# Altium project Solenoid-Switching-Board-v1.0.PrjPcb (part 5 of 5)
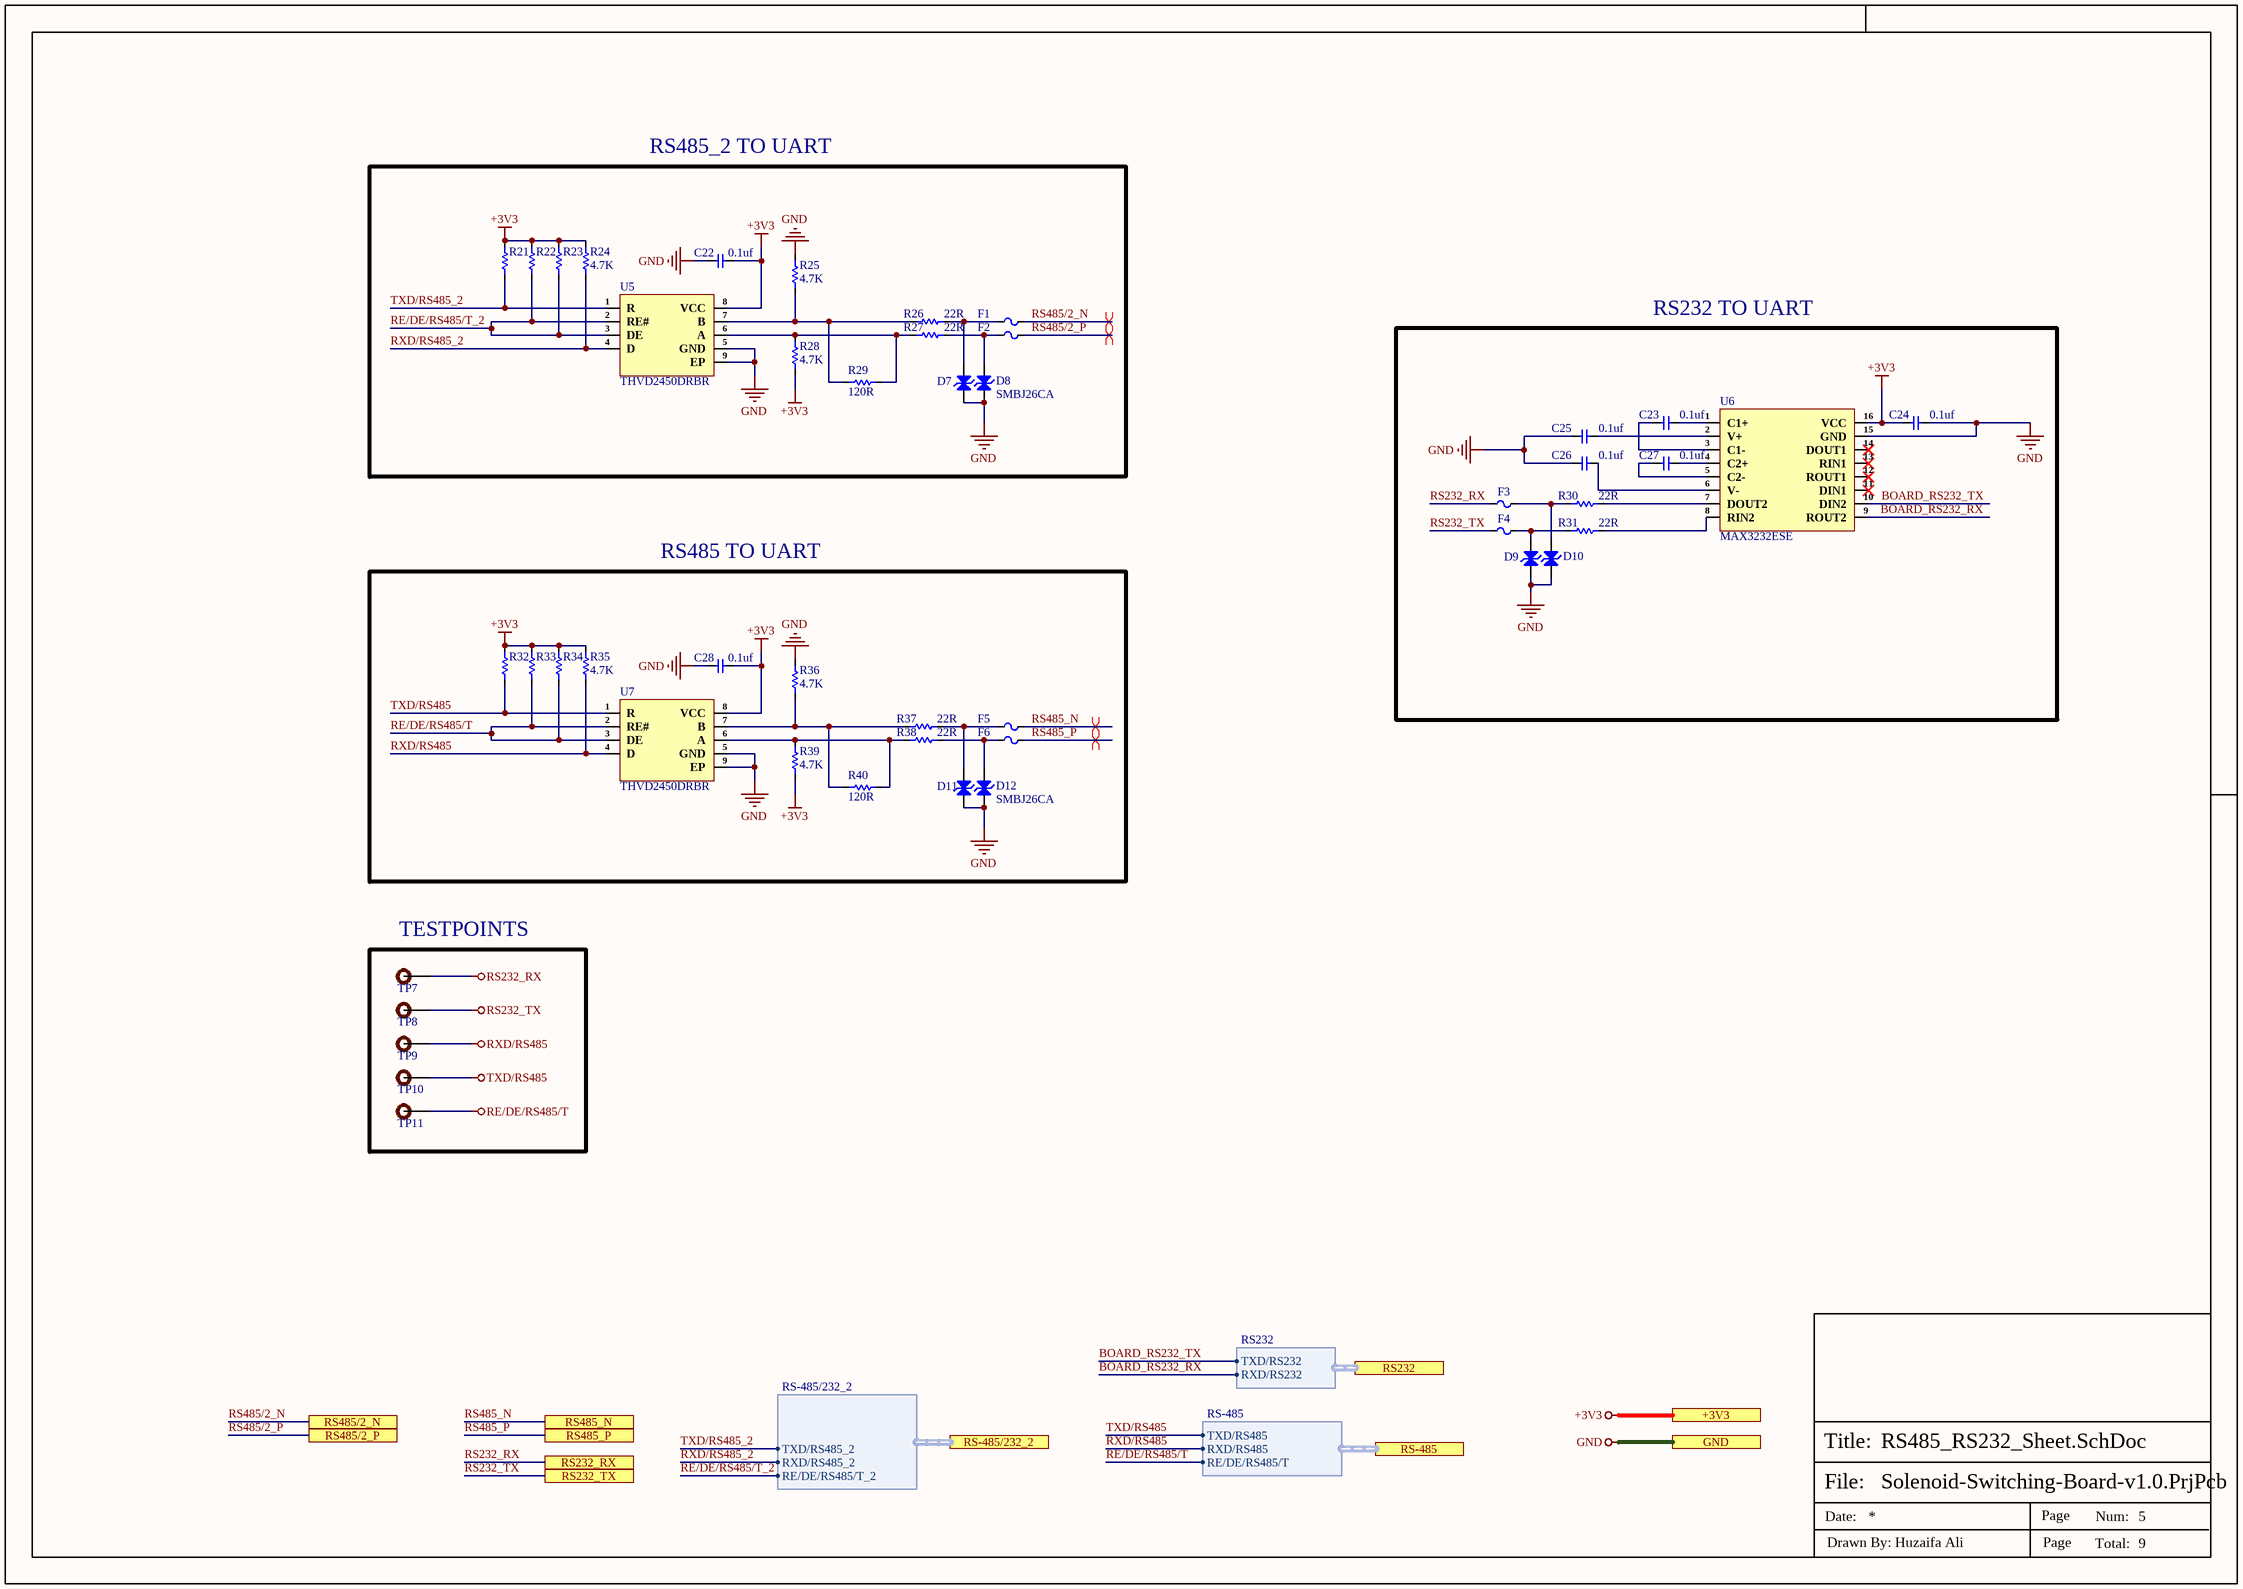
[diagram p9: RS485_RS232_Sheet.SchDoc]

## Nets that join several sheets
+3V3: CAN_Sheet (C20.2 U4.5), Controller_Sheet (10 pins), EtherCAT_Sheet (19 pins), Power_Sheet (5 pins), RJ45_Sheet (12 pins), RS485_RS232_Sheet (16 pins)
+5V: CAN_Sheet (6 pins), Power_Sheet (7 pins)
+24V: Connector_Sheet (34 pins), Power_Sheet (10 pins)
CAN_RX: CAN_Sheet (TP5.1 U4.4), Controller_Sheet (U3.15)
CAN_TX: CAN_Sheet (TP6.1 U4.1), Controller_Sheet (U3.16)
CHASIS GND: Connector_Sheet (16 pins), RJ45_Sheet (7 pins)
GND: CAN_Sheet (8 pins), Connector_Sheet (D13.1 J12.3 J16.1), Controller_Sheet (27 pins), EtherCAT_Sheet (26 pins), MOSFET_Sheet (48 pins), Power_Sheet (22 pins), RJ45_Sheet (10 pins), RS485_RS232_Sheet (18 pins)
RE/DE/RS485/T: Controller_Sheet (U3.20), RS485_RS232_Sheet (5 pins)
RS232_RX: Connector_Sheet (J15.2), RS485_RS232_Sheet (F3.1 TP7.1)
RS232_TX: Connector_Sheet (J15.1), RS485_RS232_Sheet (F4.1 TP8.1)
RXD/RS485: Controller_Sheet (U3.21), RS485_RS232_Sheet (R35.1 TP9.1 U7.4)
TXD/RS485: Controller_Sheet (U3.22), RS485_RS232_Sheet (R32.1 TP10.1 U7.1)
BOARD_RS232_RX: Controller_Sheet (U3.56), RS485_RS232_Sheet (U6.9)
BOARD_RS232_TX: Controller_Sheet (U3.55), RS485_RS232_Sheet (U6.10)
CAN_N: CAN_Sheet (R20.2 U4.12), Connector_Sheet (J12.2)
CAN_P: CAN_Sheet (R18.1 U4.13), Connector_Sheet (J12.1)
CONN1_NEG: Connector_Sheet (D17.2 J7.2), MOSFET_Sheet (Q1.2 Q1.4)
CONN2_NEG: Connector_Sheet (D22.2 J7.5), MOSFET_Sheet (Q2.2 Q2.4)
CONN3_NEG: Connector_Sheet (D26.2 J7.8), MOSFET_Sheet (Q3.2 Q3.4)
CONN4_NEG: Connector_Sheet (D30.2 J7.11), MOSFET_Sheet (Q4.2 Q4.4)
CONN5_NEG: Connector_Sheet (D19.2 J8.2), MOSFET_Sheet (Q5.2 Q5.4)
CONN6_NEG: Connector_Sheet (D23.2 J8.5), MOSFET_Sheet (Q6.2 Q6.4)
CONN7_NEG: Connector_Sheet (D27.2 J8.8), MOSFET_Sheet (Q7.2 Q7.4)
CONN8_NEG: Connector_Sheet (D31.2 J8.11), MOSFET_Sheet (Q8.2 Q8.4)
CONN9_NEG: Connector_Sheet (D20.2 J13.2), MOSFET_Sheet (Q9.2 Q9.4)
CONN10_NEG: Connector_Sheet (D24.2 J13.5), MOSFET_Sheet (Q10.2 Q10.4)
CONN11_NEG: Connector_Sheet (D28.2 J13.8), MOSFET_Sheet (Q11.2 Q11.4)
CONN12_NEG: Connector_Sheet (D32.2 J13.11), MOSFET_Sheet (Q12.2 Q12.4)
CONN13_NEG: Connector_Sheet (D21.2 J18.2), MOSFET_Sheet (Q13.2 Q13.4)
CONN14_NEG: Connector_Sheet (D25.2 J18.5), MOSFET_Sheet (Q14.2 Q14.4)
CONN15_NEG: Connector_Sheet (D29.2 J18.8), MOSFET_Sheet (Q15.2 Q15.4)
CONN16_NEG: Connector_Sheet (D33.2 J18.11), MOSFET_Sheet (Q16.2 Q16.4)
EN_CAN: CAN_Sheet (U4.6), Controller_Sheet (U3.36)
G1: Controller_Sheet (U3.2), MOSFET_Sheet (R64.2 R67.2)
G2: Controller_Sheet (U3.3), MOSFET_Sheet (R65.2 R68.2)
G3: Controller_Sheet (U3.41), MOSFET_Sheet (R66.2 R69.2)
G4: Controller_Sheet (U3.40), MOSFET_Sheet (R70.2 R99.2)
G5: Controller_Sheet (U3.23), MOSFET_Sheet (R75.2 R100.2)
G6: Controller_Sheet (U3.24), MOSFET_Sheet (R76.2 R101.2)
G7: Controller_Sheet (U3.25), MOSFET_Sheet (R77.2 R102.2)
G8: Controller_Sheet (U3.26), MOSFET_Sheet (R78.2 R103.2)
G9: Controller_Sheet (U3.27), MOSFET_Sheet (R83.2 R104.2)
G10: Controller_Sheet (U3.28), MOSFET_Sheet (R84.2 R105.2)
G11: Controller_Sheet (U3.29), MOSFET_Sheet (R85.2 R106.2)
G12: Controller_Sheet (U3.30), MOSFET_Sheet (R86.2 R107.2)
G13: Controller_Sheet (U3.31), MOSFET_Sheet (R91.2 R108.2)
G14: Controller_Sheet (U3.32), MOSFET_Sheet (R92.2 R109.2)
G15: Controller_Sheet (U3.34), MOSFET_Sheet (R93.2 R110.2)
G16: Controller_Sheet (U3.33), MOSFET_Sheet (R94.2 R111.2)
INH_MASK: CAN_Sheet (U4.11), Controller_Sheet (U3.35)
LEDPOL0: EtherCAT_Sheet (R46.2 U8.48), RJ45_Sheet (R57.1)
LEDPOL1: EtherCAT_Sheet (R47.2 U8.46), RJ45_Sheet (R58.1)
nFAULT_CAN: CAN_Sheet (U4.8), Controller_Sheet (U3.39)
nSTB_CAN: CAN_Sheet (U4.14), Controller_Sheet (U3.38)
RE/DE/RS485/T_2: Controller_Sheet (U3.19), RS485_RS232_Sheet (R22.1 R23.1 U5.2 U5.3)
RS485/2_N: Connector_Sheet (J11.2), RS485_RS232_Sheet (F1.2)
RS485/2_P: Connector_Sheet (J11.1), RS485_RS232_Sheet (F2.2)
RS485_N: Connector_Sheet (J14.2), RS485_RS232_Sheet (F5.2)
RS485_P: Connector_Sheet (J14.1), RS485_RS232_Sheet (F6.2)
RXA_N: EtherCAT_Sheet (U8.54), RJ45_Sheet (C45.2 J9.6 R51.1)
RXA_P: EtherCAT_Sheet (U8.55), RJ45_Sheet (C46.2 J9.3 R52.1)
RXB_N: EtherCAT_Sheet (U8.61), RJ45_Sheet (C51.2 J10.6 R59.1)
RXB_P: EtherCAT_Sheet (U8.60), RJ45_Sheet (C52.2 J10.3 R60.1)
RXD/RS485_2: Controller_Sheet (U3.17), RS485_RS232_Sheet (R24.1 U5.4)
SPI2_MISO: Controller_Sheet (U3.53), EtherCAT_Sheet (U8.13)
SPI2_MOSI: Controller_Sheet (U3.54), EtherCAT_Sheet (U8.17)
SPI2_NSS: Controller_Sheet (U3.50), EtherCAT_Sheet (U8.50)
SPI2_SCK: Controller_Sheet (U3.51), EtherCAT_Sheet (U8.19)
SYNC0: Controller_Sheet (U3.14), EtherCAT_Sheet (U8.34)
SYNC1: Controller_Sheet (U3.13), EtherCAT_Sheet (U8.18)
TXA_N: EtherCAT_Sheet (U8.52), RJ45_Sheet (C47.2 J9.2 R53.1)
TXA_P: EtherCAT_Sheet (U8.53), RJ45_Sheet (C48.2 J9.1 R54.1)
TXB_N: EtherCAT_Sheet (U8.63), RJ45_Sheet (C53.2 J10.2 R61.1)
TXB_P: EtherCAT_Sheet (U8.62), RJ45_Sheet (C54.2 J10.1 R62.1)
TXD/RS485_2: Controller_Sheet (U3.18), RS485_RS232_Sheet (R21.1 U5.1)